# EAGLE design stk200 (EAGLE 7.1.0)
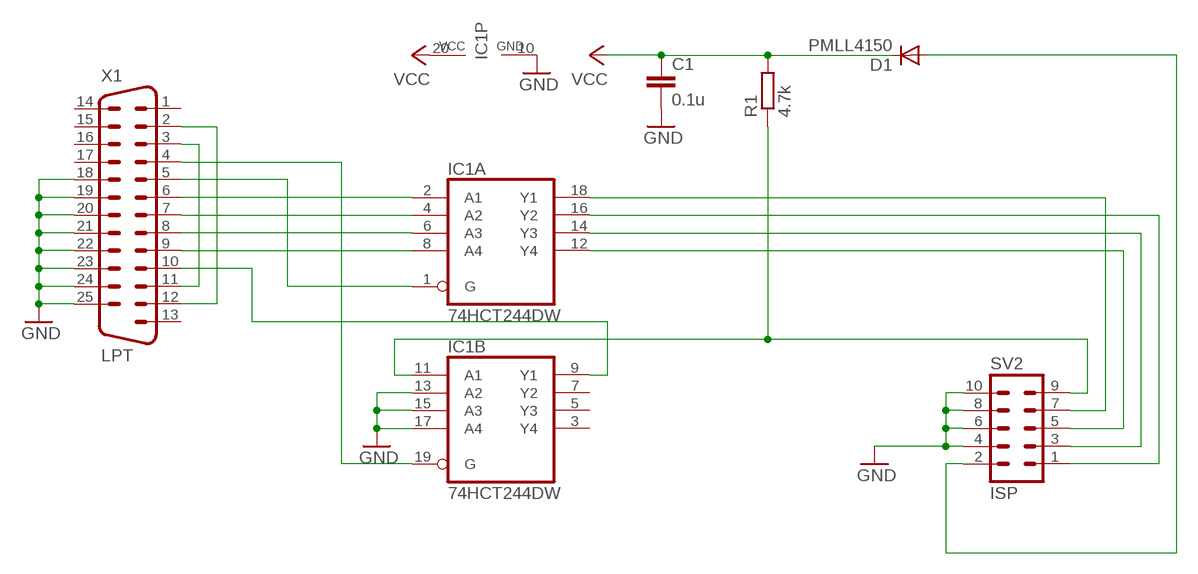
[diagram p0: schematic, sheet 1]

## Parts
C1  0.1u  C-EUC0805  [C0805]
D1  PMLL4150  [SOD80C]
IC1  74HCT244DW  [SO20W]
R1  4.7k  R-EU_R0805  [R0805]
SV2  ISP  MA05-2  [MA05-2]
X1  LPT  M25D  [M25D]

## Nets
GND: C1.2 IC1.10(P:GND) IC1.13(B:A2) IC1.15(B:A3) IC1.17(B:A4) SV2.4 SV2.6 SV2.8 SV2.10 X1.18 X1.19 X1.20 X1.21 X1.22 X1.23 X1.24 X1.25
N$1: IC1.9(B:Y1) X1.10
N$2: IC1.2(A:A1) X1.6
N$3: IC1.4(A:A2) X1.7
N$4: IC1.1(A:G) X1.5
N$5: IC1.8(A:A4) X1.9
N$6: IC1.16(A:Y2) SV2.1
N$7: IC1.19(B:G) X1.4
N$8: D1.A SV2.2
N$9: IC1.11(B:A1) R1.1 SV2.9
N$10: IC1.14(A:Y3) SV2.3
N$11: IC1.12(A:Y4) SV2.5
N$12: IC1.6(A:A3) X1.8
N$13: IC1.18(A:Y1) SV2.7
N$15: X1.3 X1.11
N$16: X1.2 X1.12
VCC: C1.1 D1.C IC1.20(P:VCC) R1.2
Unconnected: IC1.3(B:Y4) IC1.5(B:Y3) IC1.7(B:Y2) X1.1 X1.13 X1.14 X1.15 X1.16 X1.17

## Library data of the parts
C1 = rcl:C-EU: CAPACITOR, European symbol
D1 = diode:PMLL4150: DIODE high speed
IC1 = 74xx-eu:74*244: Octal BUFFER and LINE DRIVER, 3-state
R1 = rcl:R-EU_: RESISTOR, European symbol
SV2 = con-lstb:MA05-2: PIN HEADER
X1 = con-subd:M25: SUB-D

## Board
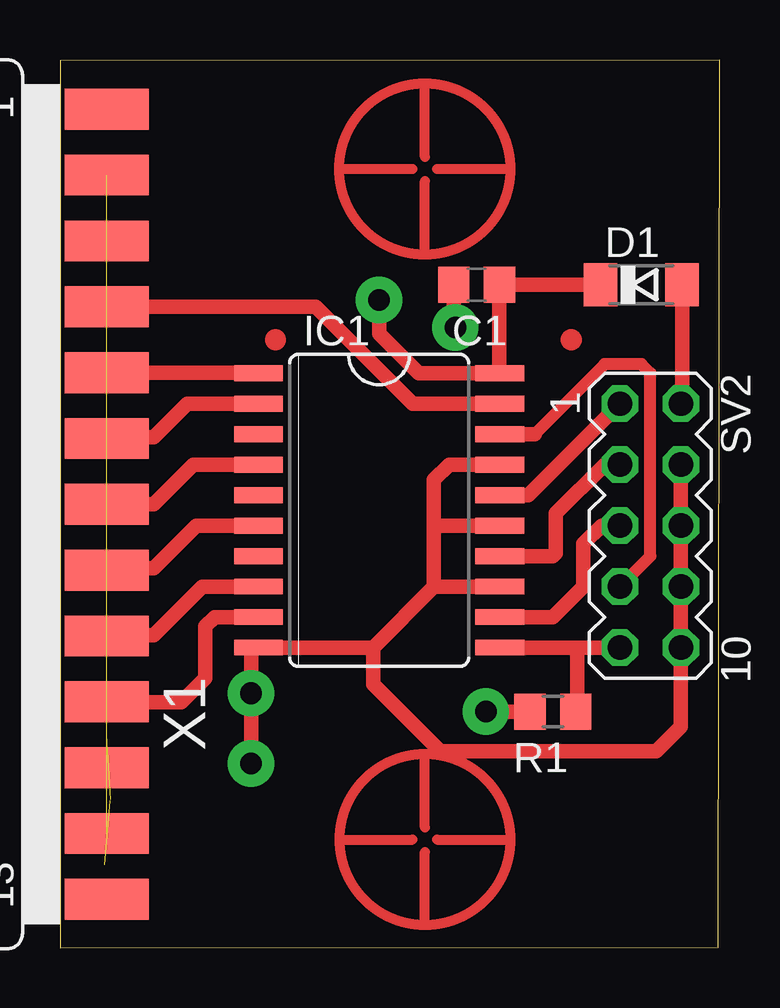
[diagram p1: board, top side]
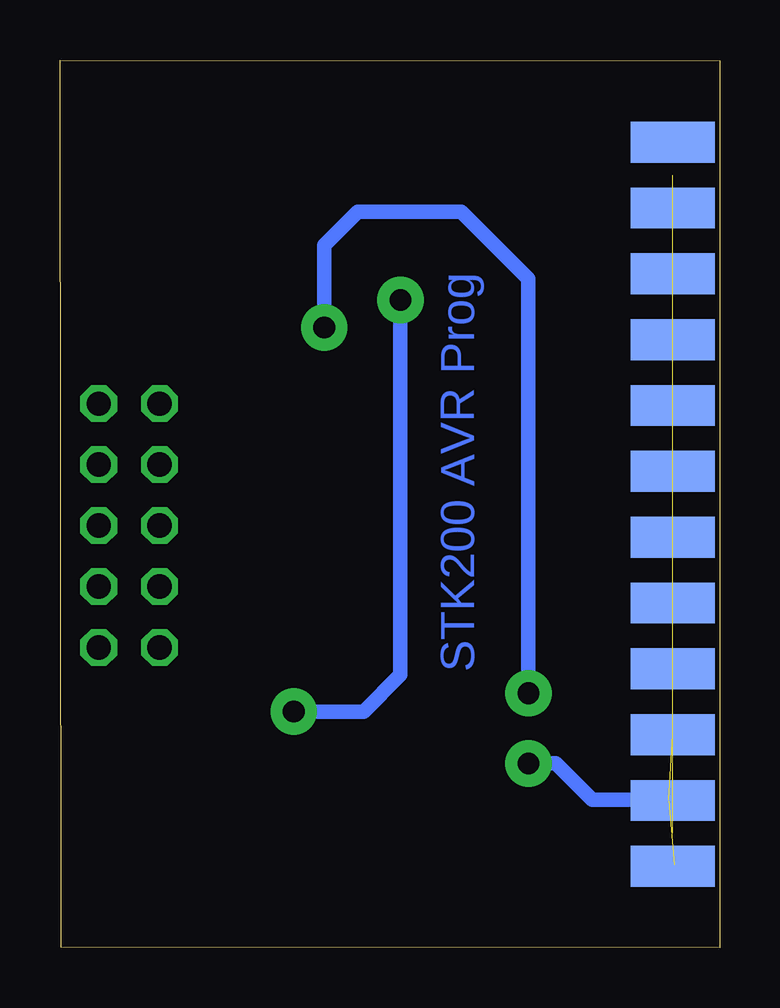
[diagram p2: board, bottom side, seen from below]

Size 27.48 x 37 mm. Coordinates in mm from the lower left corner, seen from the top.
Outline: 0,0 27.43,0.03 27.48,37 0,36.97 0,0
Copper layers (1*16): Top 0.035mm / dielectric 1.5mm / Bottom 0.035mm
Design rules "dimka": minimum track width 10mil, minimum drill 24mil, track to track 10mil, track to pad 10mil, pad to pad 10mil, via to via 10mil, smd to smd 10mil, copper to edge 40mil, drill to drill 10mil, minimum pad ring 10mil, minimum via ring 8mil, stop-mask expansion 4mil, vias tented up to drill 0mil, thermal gap 10mil

### Footprints (pad centres in the part's own frame; a part is rotated, then mirrored left to right if it is on the bottom)
C0805 = smd 1.3 x 1.5: 1 -0.95,0; 2 0.95,0
SOD80C = smd 1.4 x 1.8: A 1.7,0; C -1.7,0
SO20W = smd 0.66 x 2.032: 1 -5.715,-5.029; 2 -4.445,-5.029; 3 -3.175,-5.029; 4 -1.905,-5.029; 5 -0.635,-5.029; 6 0.635,-5.029; 7 1.905,-5.029; 8 3.175,-5.029; 9 4.445,-5.029; 10 5.715,-5.029; 11 5.715,5.029; 12 4.445,5.029; 13 3.175,5.029; 14 1.905,5.029; 15 0.635,5.029; 16 -0.635,5.029; 17 -1.905,5.029; 18 -3.175,5.029; 19 -4.445,5.029; 20 -5.715,5.029
R0805 = smd 1.3 x 1.5: 1 -0.95,0; 2 0.95,0
MA05-2 = drill 1.016 octagon: 1 -5.08,-1.27; 2 -5.08,1.27; 3 -2.54,-1.27; 4 -2.54,1.27; 5 0,-1.27; 6 0,1.27; 7 2.54,-1.27; 8 2.54,1.27; 9 5.08,-1.27; 10 5.08,1.27
M25D = smd 1.7 x 3.5: 1 16.459,-6.045; 2 13.716,-6.045; 3 10.973,-6.045; 4 8.23,-6.045; 5 5.486,-6.045; 6 2.743,-6.045; 7 0,-6.045; 8 -2.743,-6.045; 9 -5.486,-6.045; 10 -8.23,-6.045; 11 -10.973,-6.045; 12 -13.716,-6.045; 13 -16.459,-6.045 | smd 1.7 x 3.5 bottom: 14 15.088,-6.045; 15 12.344,-6.045; 16 9.601,-6.045; 17 6.858,-6.045; 18 4.115,-6.045; 19 1.372,-6.045; 20 -1.372,-6.045; 21 -4.115,-6.045; 22 -6.858,-6.045; 23 -9.601,-6.045; 24 -12.344,-6.045; 25 -15.088,-6.045

### Placement (x,y rotation side)
C1  17.36,27.63 180 top
D1  24.22,27.63 0 top
IC1  13.3,18.23 270 top
R1  20.54,9.85 180 top
SV2  24.6,17.6 270 top
X1  -4.1,18.49 90 top

### Tracks (layer width: path | path; a pad name or v marks a point on that pad's centre or on a via)
GND  (via drill 0.9 pad 1.93)  (7 unrouted)
  Top 0.508: SV2.4 SV2.6 SV2.8 SV2.10 25.74,12.39
  Top 0.61: C1.2 16.41,25.91 v16.47,25.85 | IC1.17 16.22,20.14 15.58,19.5 | 15.58,15.06 15.58,17.6 | 15.58,17.6 15.58,19.5 | 15.58,17.6 IC1.15 | 15.58,15.06 IC1.13 | 15.58,15.06 15.58,19.5 | 7.96,12.52 IC1.10 | 13.04,12.52 15.58,15.06 | SV2.10 SV2.4 | 7.96,12.52 13.04,12.52 | 13.04,12.52 13.04,10.99 15.84,8.2 24.85,8.2 25.87,9.22 25.87,12.26 25.74,12.39 | 7.96,12.52 v7.96,10.61 v7.96,7.69
  Bottom 0.508: 1.87,6.17 1.92,6.17 X1.24 | X1.25 1.87,3.48
  Bottom 0.61: 15.96,25.85 v16.47,25.85 16.47,29.28 15.07,30.68 10.76,30.68 7.96,27.88 v7.96,10.61 | v7.96,7.69 6.82,7.69 5.3,6.17 2.12,6.17 2.1,6.14 X1.24
N$1
  Top 0.61: IC1.9 6.44,13.79 6.06,13.41 6.06,11.25 5.04,10.23 1.97,10.23 X1.10
N$2
  Top 0.61: IC1.2 5.3,22.68 3.9,21.28 2.12,21.28 2.07,21.23 X1.6
N$3
  Top 0.61: IC1.4 5.55,20.14 3.9,18.49 X1.7
N$4
  Top 0.61: IC1.1 8.22,23.95 8.22,23.97 X1.5
N$5
  Top 0.61: IC1.8 5.93,15.06 3.9,13.03 1.99,13.03 1.97,13 X1.9
N$6
  Top 0.61: IC1.16 19.52,18.87 SV2.1
N$7
  Top 0.61: X1.4 10.65,26.72 14.69,22.68 IC1.19
N$8
  Top 0.61: D1.A 25.92,23.62 SV2.2
N$9
  Top 0.61: IC1.11 21.55,12.52 | 21.55,12.52 22.19,12.52 | 22.19,12.52 22.44,12.52 | R1.1 21.55,9.92 21.55,12.52 | 22.19,12.52 SV2.9
N$10
  Top 0.61: IC1.14 20.54,16.33 20.66,16.45 20.66,18.11 22.7,20.14 SV2.3
N$11
  Top 0.61: IC1.12 20.54,13.79 21.81,15.06 21.81,16.84 22.57,17.6 SV2.5
N$12
  Top 0.61: IC1.6 5.68,17.6 3.9,15.82 1.99,15.82 1.94,15.77 X1.8
N$13
  Top 0.508: SV2.7 24.6,16.33 24.6,23.95 24.22,24.33 22.7,24.33 19.77,21.41 | IC1.18 19.65,21.41
  Top 0.61: 18.25,21.41 19.65,21.41 19.77,21.41
N$14
  Top 0.406: 11.65,4.52 14.69,4.52
N$15  (1 unrouted)
N$16  (1 unrouted)
N$17
  Top 0.406: 11.65,32.46 14.69,32.46
N$18
  Top 0.406: 15.2,32.96 15.2,36.01
N$19
  Top 0.406: 15.71,4.52 18.76,4.52
N$20
  Top 0.406: 15.2,5.02 15.2,8.07
N$21
  Top 0.406: 15.2,0.96 15.2,4.01
N$22
  Top 0.406: 15.71,32.46 18.76,32.46
N$23
  Top 0.406: 15.2,28.9 15.2,31.95
VCC  (via drill 0.9 pad 1.93)
  Top 0.61: 18.25,23.95 IC1.20 | C1.1 18.31,24.01 18.25,23.95 | C1.1 18.25,27.63 | C1.1 D1.C | 18.25,23.95 14.95,23.95 13.3,25.6 v13.3,27 | R1.2 18,9.85 v17.74,9.85
  Bottom 0.61: v13.3,27 13.3,11.37 14.82,9.85 v17.74,9.85
(copper drawn outside any net)
  shapes: Top circle x4

### Text on the board
Bottom: STK200 AVR Prog